# Altium schematic sheet Potencia.SchDoc
size A4; Engineer: Triggerr; DocumentNumber: 3; Revision: V 2.0; SheetNumber: 1; SheetTotal: 4; DocumentName: Potencia
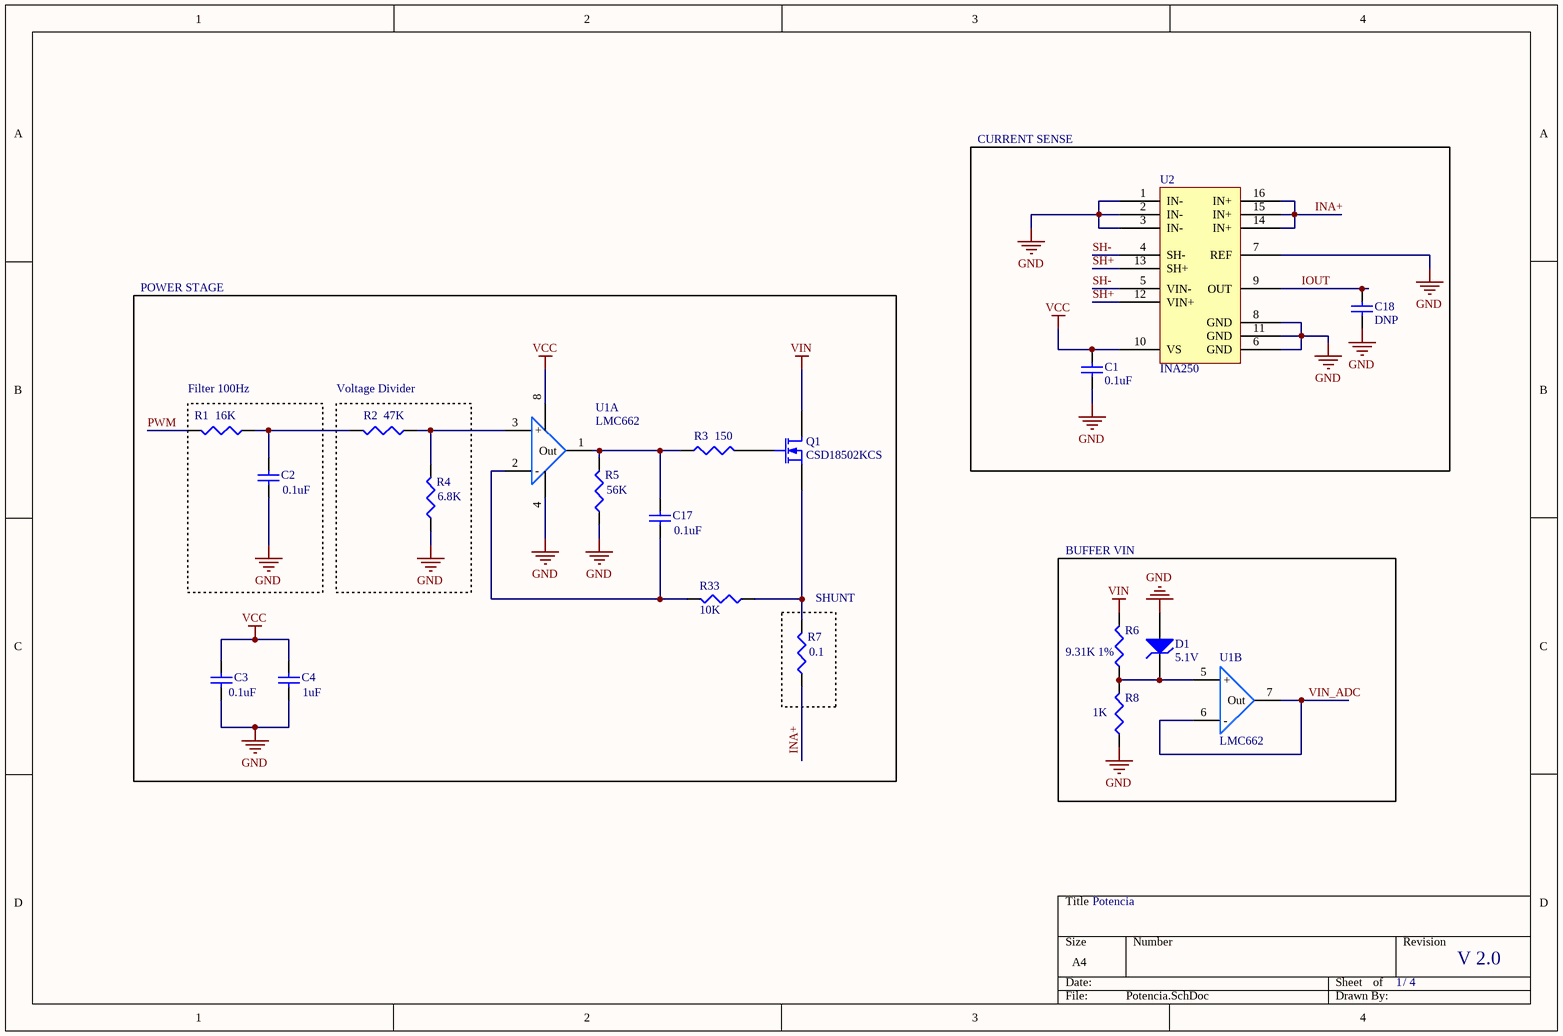
[diagram p0: Potencia.SchDoc]

## Parts
C1  0.1uF  [C0805]
C2  value 0.1uF  [C0805]  (hidden comment: Cap)
C3  0.1uF  [C0805]
C4  value 1uF  [C0805]  (hidden comment: Cap)
C17  value 0.1uF  [C0805]  (hidden comment: Cap)
C18  DNP  [C0805]
D1  5.1V  [C1206]
Q1  CSD18502KCS  [TO-220AB]
R1  value 16K  [6-0805_N]  (hidden comment: Res)
R2  47K  [6-0805_N]
R3  value 150  [6-0805_N]  (hidden comment: Res)
R4  6.8K  [6-0805_N]
R5  56K  [6-0805_N]
R6  9.31K 1%  [6-0805_N]
R7  value 0.1  [RESC6332]  (hidden comment: Res)
R8  1K  [6-0805_N]
R33  10K  [6-0805_N]
U1  LMC662  [SOIC-OA8_N]  (parts A,B of 2)
U2  INA250  [TSSOP-ST16_N]

## Blocks framed on the sheet
CURRENT SENSE: C1 C18 U2
POWER STAGE: C3 C4 C17 Q1 R3 R5 R33 U1
Filter 100Hz: C2 R1
Voltage Divider: R2 R4
BUFFER VIN: D1 R6 R8 U1
SHUNT: R7

## Nets
GND: C1.1 C2.1 C3.2 C4.1 C18.1 D1.1(A) R4.1 R5.1 R8.1 U1.4(Vss) U2.1(IN-) U2.2(IN-) U2.3(IN-) U2.6(GND) U2.7(REF) U2.8(GND) U2.11(GND)
VCC: C1.2 C3.1 C4.2 U1.8(Vdd) U2.10(VS)
VIN: Q1.2(D) R6.2
INA+: R7.1 U2.14(IN+) U2.15(IN+) U2.16(IN+)
IOUT: C18.2 U2.9(OUT)
PWM: R1.2
SH+: U2.12(VIN+) U2.13(SH+)
SH-: U2.4(SH-) U2.5(VIN-)
VIN_ADC: U1.6(-) U1.7(Out)
NetC2_2: C2.2 R1.1 R2.2
NetC17_1: C17.1 R33.2 U1.2(-)
NetC17_2: C17.2 R3.1 R5.2 U1.1(Out)
NetD1_2: D1.2(K) R6.1 R8.2 U1.5(+)
NetQ1_1: Q1.1(G) R3.2
NetQ1_3: Q1.3(S) R7.2 R33.1
NetR2_1: R2.1 R4.2 U1.3(+)

## Notes on the sheet
- /

## Library data of the parts
C1 C2 C4 C17 = Cap: Capacitor; Published: 8-Jun-2000; LatestRevisionDate: 17-Jul-2002; LatestRevisionNote: Re-released for DXP Platform.; PackageReference: RAD-0.3; Publisher: Altium Limited; PackageDescription: Radial Cap, Thru-Hole; 2 Leads; 0.3 in Pin Spacing
  C1: Value: 0.1uF
C3 C18 = Cap: Capacitor; Value: 01.uF; Published: 8-Jun-2000; LatestRevisionDate: 17-Jul-2002; LatestRevisionNote: Re-released for DXP Platform.; PackageReference: RAD-0.3; Publisher: Altium Limited; PackageDescription: Radial Cap, Thru-Hole; 2 Leads; 0.3 in Pin Spacing
D1 = D Zener: Zener Diode; Published: 8-Jun-2000; LatestRevisionDate: 17-Jul-2002; LatestRevisionNote: Re-released for DXP Platform.; PackageReference: DIODE-0.7; Publisher: Altium Limited; PackageDescription: Diode, Thru-Hole; 2 Leads; 0.7 in Pin Spacing
Q1 = MOSFET-N: N-Channel MOSFET; Published: 8-Jun-2000; LatestRevisionDate: 17-Jul-2002; LatestRevisionNote: Re-released for DXP Platform.; PackageVersion: 1995/1996; PackageReference: E3; Publisher: Altium Limited; PackageDescription: TO, Flat Index; 3 In-Line, Axial Leads; Body Dia. 4.6mm; Lead Dia. 0.5 mm (max)
R1-R5 R7 R8 R33 = Res3: Resistor; Published: 8-Jun-2000; LatestRevisionDate: 29-May-2009; LatestRevisionNote: IPC-7351 Footprint Added.; PackageReference: J1-0603; Publisher: Altium Limited; PackageDescription: Chip Resistor
  R2: Value: 47K
  R4: Value: 6.8K
  R5: Value: 56K
  R33: Value: 10K
R6 = Res3: Resistor; Value: ??; Published: 8-Jun-2000; LatestRevisionDate: 29-May-2009; LatestRevisionNote: IPC-7351 Footprint Added.; PackageReference: J1-0603; Publisher: Altium Limited; PackageDescription: Chip Resistor